# EAGLE design TCM8240MD_Breakout-v12 (EAGLE 5.10)
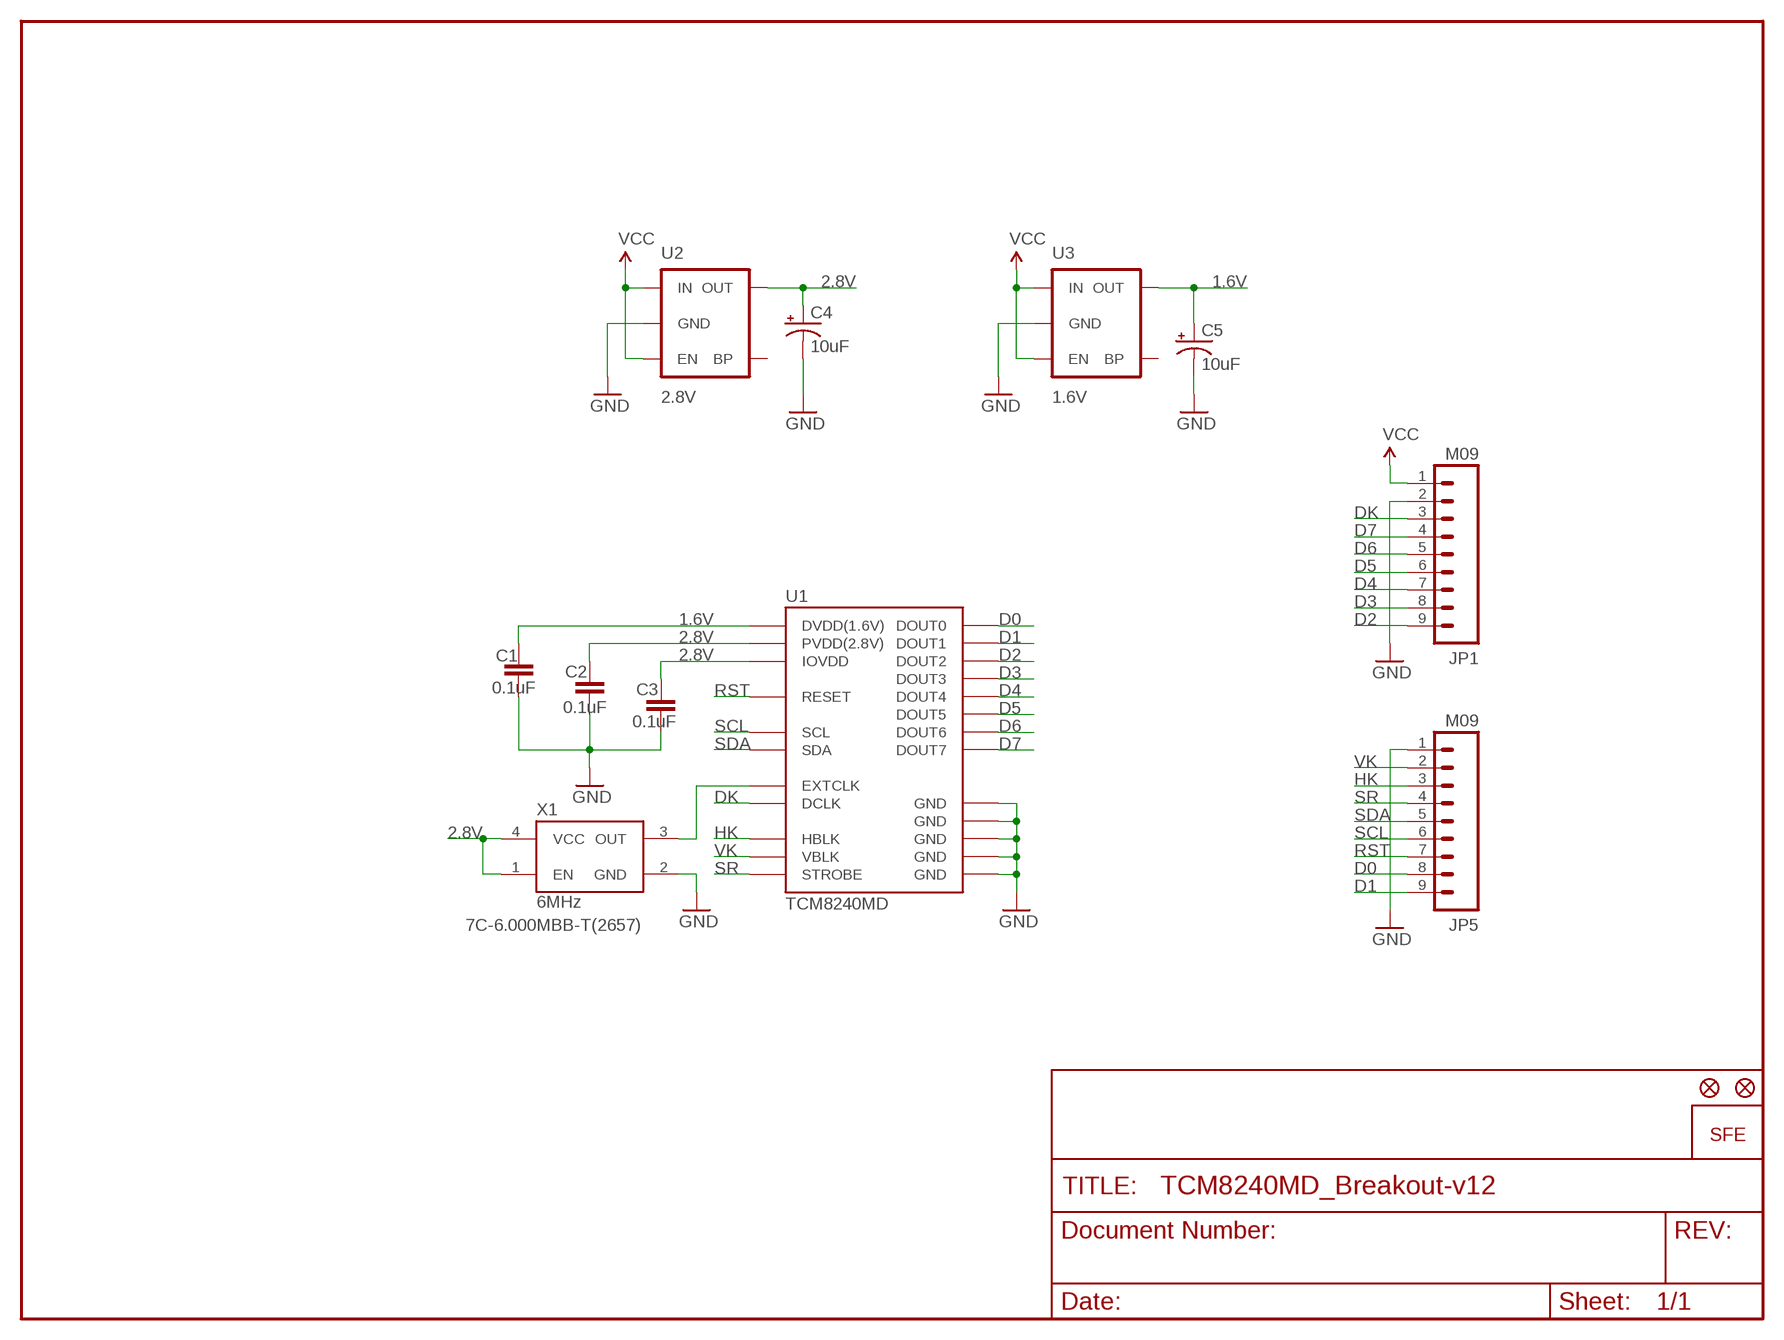
[diagram p0: schematic, sheet 1]

## Parts
C1  0.1uF  CAP0402-CAP  [0402-CAP]
C2  0.1uF  CAP0402-CAP  [0402-CAP]
C3  0.1uF  CAP0402-CAP  [0402-CAP]
C4  10uF  CAP_POL1206  [EIA3216]
C5  10uF  CAP_POL1206  [EIA3216]
JP1  M09  [1X09]
JP2  LOGO-SFENEW  [SFE-NEW-WEBLOGO]
JP3  FIDUCIAL1X2  [FIDUCIAL-1X2]
JP4  FIDUCIAL1X2  [FIDUCIAL-1X2]
JP5  M09  [1X09]
U1  TCM8240MD  [TCM8240MD]
U2  2.8V  V_REG_LDOSMD  [SOT23-5]
U3  1.6V  V_REG_LDOSMD  [SOT23-5]
X1  6MHz  OSCILLATOR5X3-PIN1-INDICATED  [CRYSTAL-OSC-SMD-5X3]

## Nets
1.6V: C1.1 C5.A(+) U1.P$12(DVDD(1.6V)) U3.5(OUT)
2.8V: C2.1 C3.1 C4.A(+) U1.P$6(PVDD(2.8V)) U1.P$18(IOVDD) U2.5(OUT) X1.1(EN) X1.4(VCC)
D0: JP5.8 U1.P$4(DOUT0)
D1: JP5.9 U1.P$3(DOUT1)
D2: JP1.9 U1.P$2(DOUT2)
D3: JP1.8 U1.P$1(DOUT3)
D4: JP1.7 U1.P$24(DOUT4)
D5: JP1.6 U1.P$23(DOUT5)
D6: JP1.5 U1.P$22(DOUT6)
D7: JP1.4 U1.P$21(DOUT7)
DK: JP1.3 U1.P$19(DCLK)
EXTCLK: U1.P$13(EXTCLK) X1.3(OUT)
GND: C1.2 C2.2 C3.2 C4.C(-) C5.C(-) JP1.2 JP5.1 U1.P$5(GND) U1.P$9(GND) U1.P$11(GND) U1.P$17(GND) U1.P$20(GND) U2.2(GND) U3.2(GND) X1.2(GND)
HK: JP5.3 U1.P$15(HBLK)
RST: JP5.7 U1.P$7(RESET)
SCL: JP5.6 U1.P$8(SCL)
SDA: JP5.5 U1.P$10(SDA)
SR: JP5.4 U1.P$14(STROBE)
VCC: JP1.1 U2.1(IN) U2.3(EN) U3.1(IN) U3.3(EN)
VK: JP5.2 U1.P$16(VBLK)
Unconnected: U2.4(BP) U3.4(BP)

## Notes on the sheet
- 7C-6.000MBB-T(2657)

## Library data of the parts
C1-C3 = SparkFun:CAP: Capacitor Standard 0603 ceramic capacitor, and 0.1" leaded capacitor.
C4 C5 = SparkFun:CAP_POL: Capacitor Polarized These are standard SMD and PTH capacitors. Normally 10uF, 47uF, and 100uF in electrolytic and tantalum varieties. Always verify the external diameter of the through hole cap, it varies with capacity, voltage, and manufacturer. The EIA devices should be standard.
JP1 JP5 = SparkFun:M09: Header 9 Standard 9-pin 0.1" header. Use with straight break away headers (SKU : PRT-00116), right angle break away headers (PRT-00553), swiss pins (PRT-00743), machine pins (PRT-00117), and female headers (PRT-00115).
JP2 = SparkFun:LOGO-SFE: Spark Fun Electronics PCB Logo This is the standard Spark Fun Electronics PCB logo.
JP3 JP4 = SparkFun:FIDUCIAL: Fiducial Alignment Points Various fiducial points for machine vision alignment.
U1 = SparkFun:TCM8240MD
U2 U3 = SparkFun:V_REG_LDO: Voltage Regulator LDO Standard 150mA LDO voltage regulator in SOT-23 layout. Micrel part MIC5205. BP (by-pass) pin is used to lower output noise with 470pF cap.
X1 = SparkFun:OSCILLATOR

## Board
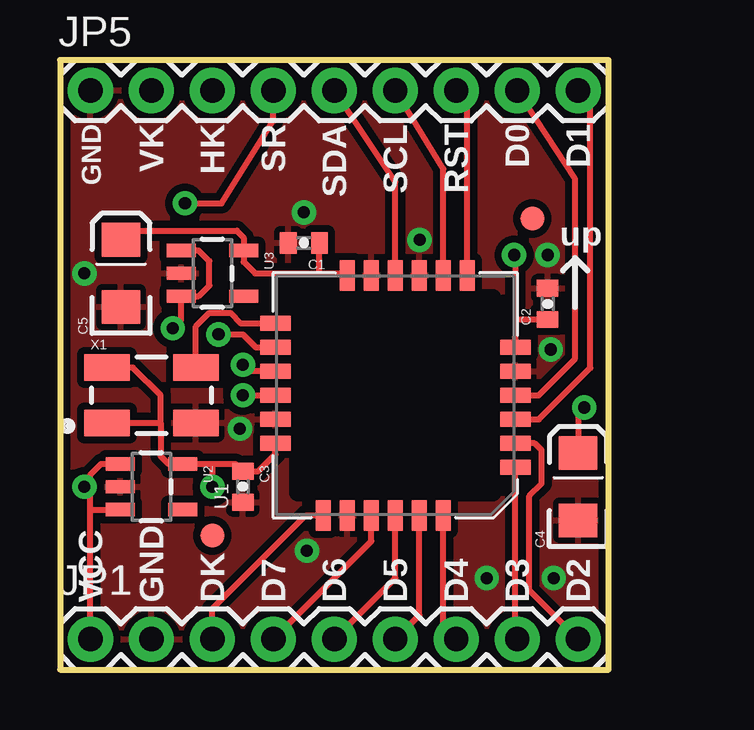
[diagram p1: board, top side]
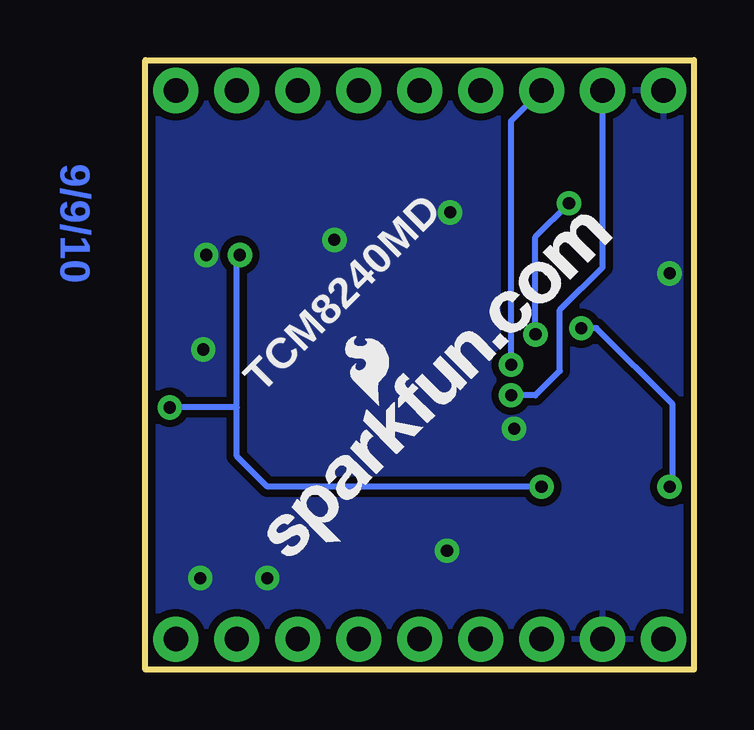
[diagram p2: board, bottom side, seen from below]

Size 22.86 x 25.4 mm. Coordinates in mm from the lower left corner, seen from the top.
Outline: 0,0 22.86,0 22.86,25.4 0,25.4 0,0
Copper layers (1*16): Top 0.035mm / dielectric 1.5mm / Bottom 0.035mm
Design rules "SparkFun": minimum track width 8mil, minimum drill 20mil, track to track 8mil, track to pad 8mil, pad to pad 8mil, via to via 8mil, smd to smd 8mil, copper to edge 8mil, drill to drill 8mil, minimum pad ring 12mil, minimum via ring 10mil, stop-mask expansion 4mil, vias tented up to drill 20mil, thermal gap 10mil

### Footprints (pad centres in the part's own frame; a part is rotated, then mirrored left to right if it is on the bottom)
0402-CAP = smd 0.7 x 0.9: 1 -0.65,0; 2 0.65,0
EIA3216 = smd 1.4 x 1.6: A 1.4,0; C -1.4,0
1X09 = drill 1.016 pad 1.88 round: 1 0,0; 2 2.54,0; 3 5.08,0; 4 7.62,0; 5 10.16,0; 6 12.7,0; 7 15.24,0; 8 17.78,0; 9 20.32,0
FIDUCIAL-1X2 = smd 1 x 1: 1 0,0
TCM8240MD = smd 1.27 x 0.635: P$1 -5,3; P$2 -5,2; P$3 -5,1; P$4 -5,0; P$5 -5,-1; P$6 -5,-2; P$13 5,-3; P$14 5,-2; P$15 5,-1; P$16 5,0; P$17 5,1; P$18 5,2 | smd 0.635 x 1.27: P$7 -3,-5; P$8 -2,-5; P$9 -1,-5; P$10 0,-5; P$11 1,-5; P$12 2,-5; P$19 3,5; P$20 2,5; P$21 1,5; P$22 0,5; P$23 -1,5; P$24 -2,5
SOT23-5 = smd 0.55 x 1.2: 1 -0.95,-1.3; 2 0,-1.3; 3 0.95,-1.3; 4 0.95,1.3; 5 -0.95,1.3
CRYSTAL-OSC-SMD-5X3 = smd 1.9 x 1.1: 1 -1.85,-1.15; 2 1.85,-1.15; 3 1.85,1.15; 4 -1.85,1.15

### Placement (x,y rotation side)
C1  10.16,17.78 180 top
C2  20.32,15.24 90 top
C3  7.62,7.62 270 top
C4  21.59,7.62 90 top
C5  2.54,16.51 90 top
JP1  1.27,1.27 0 top
JP2  16.19,3.87 45 bottom
JP3  19.68,18.8 0 top
JP4  6.35,5.59 0 top
JP5  1.27,24.13 0 top
U1  13.97,11.43 180 top
U2  3.81,7.62 270 top
U3  6.35,16.51 270 top
X1  3.81,11.43 0 top

### Tracks (layer width: path | path; a pad name or v marks a point on that pad's centre or on a via)
1.6V
  Top 0.254: 10.79,16.51 8.13,16.51 7.65,16.99 U3.5 7.65,18 7.37,18.29 2.92,18.29 | 10.79,16.51 11.89,16.51 U1.P$12 | C1.1 10.81,16.52 10.79,16.51 | C5.A 2.92,18.29 | 2.92,18.29 2.92,18.16 2.54,17.78
2.8V  (via drill 0.51)
  Top 0.254: X1.4 3.04,12.58 4.19,11.43 4.19,10.29 | 6.35,8.57 U2.5 4.51,8.57 4.19,8.89 4.19,10.29 | 6.35,8.57 7.32,8.57 C3.1 8.27,8.27 8.97,8.97 U1.P$18 | X1.1 4.18,10.28 4.19,10.29 | C4.A 21.59,10.67 v21.84,10.92 | 18.97,13.89 U1.P$6 18.97,14.61 | 18.97,14.61 18.97,17.23 v18.92,17.27 | C2.1 18.98,14.59 18.97,14.61 | 6.35,8.57 v6.35,7.62
  Bottom 0.254: 19.05,10.92 19.05,8.89 17.78,7.62 v6.35,7.62 | 19.05,10.92 19.05,17.14 v18.92,17.27 | 19.05,10.92 v21.84,10.92
D0
  Top 0.254: U1.P$4 19.94,11.43 21.46,12.95 21.46,20.45 JP5.8
D1
  Top 0.254: U1.P$3 19.95,10.43 22.1,12.57 22.1,23.62 JP5.9
D2
  Top 0.254: U1.P$2 19.78,9.43 20.07,9.14 20.07,7.75 19.56,7.24 19.56,3.3 JP1.9
D3
  Top 0.254: U1.P$1 18.97,1.35 JP1.8
D4
  Top 0.254: U1.P$24 15.97,1.81 JP1.7
D5
  Top 0.254: U1.P$23 14.97,2.27 JP1.6
D6
  Top 0.254: U1.P$22 13.97,3.81 JP1.5
D7
  Top 0.254: U1.P$21 12.97,5.35 JP1.4
DK
  Top 0.254: U1.P$19 10.24,6.43 6.35,2.54 JP1.3
EXTCLK
  Top 0.254: U1.P$13 7.54,14.43 7.11,14.86 6.22,14.86 5.66,14.3 X1.3
GND  (via drill 0.51)
  other vias: 7.49,10.03 10.29,4.95 14.99,17.91 20.45,13.34 10.16,19.05 1.02,16.51 17.78,3.81 20.57,3.81 20.32,17.27
  pour Bottom (isolate 0.305): 0,0 22.86,0 22.86,25.4 0,25.4
  pour Top (isolate 0.305): 0,0 22.86,0 22.86,25.4 0,25.4
HK  (via drill 0.51)
  Top 0.254: U1.P$15 7.89,12.43 v7.62,12.7
  Bottom 0.254: v7.62,12.7 7.62,22.86 JP5.3
RST
  Top 0.254: U1.P$7 16.97,23.67 JP5.7
SCL
  Top 0.254: U1.P$8 15.97,20.86 JP5.6
SDA
  Top 0.254: U1.P$10 13.97,20.32 JP5.5
SR  (via drill 0.51)
  Top 0.254: JP5.4 8.89,22.86 6.73,19.43 v5.21,19.43 | U1.P$14 8.16,13.43 7.62,13.97 v6.6,13.97
  Bottom 0.254: v6.6,13.97 6.6,18.03 v5.21,19.43
VCC  (via drill 0.51)
  Top 0.254: 1.27,7.62 1.27,8.13 1.71,8.57 U2.1 | 1.27,7.62 v1.02,7.62 | v4.7,14.22 5.05,14.57 U3.3 5.78,15.56 6.22,16 6.22,17.02 5.78,17.46 U3.1 | JP1.1 1.27,6.73 | 1.27,6.73 1.27,7.62 | 1.27,6.73 1.33,6.67 U2.3
  Bottom 0.254: v4.7,14.22 4.06,14.22 0.89,11.05 0.89,7.75 v1.02,7.62
VK  (via drill 0.51)
  Top 0.254: v7.62,11.43 U1.P$16
  Bottom 0.254: v7.62,11.43 6.6,11.43 5.59,12.45 5.59,14.99 3.81,16.76 JP5.2

### Text on the board
Bottom: 9/9/10
tPlace: GND | VK | HK | SR | SDA | SCL | RST | D0 | D1 | up | VCC | GND | DK | D7 | D6 | D5 | D4 | D3 | D2
bPlace: TCM8240MD
Reference: changes for v12 | make board fit on 0.1" grid